# EAGLE schematic eightbyeight-teardrop (EAGLE 7.6.0)

## Sheet 1 of 6
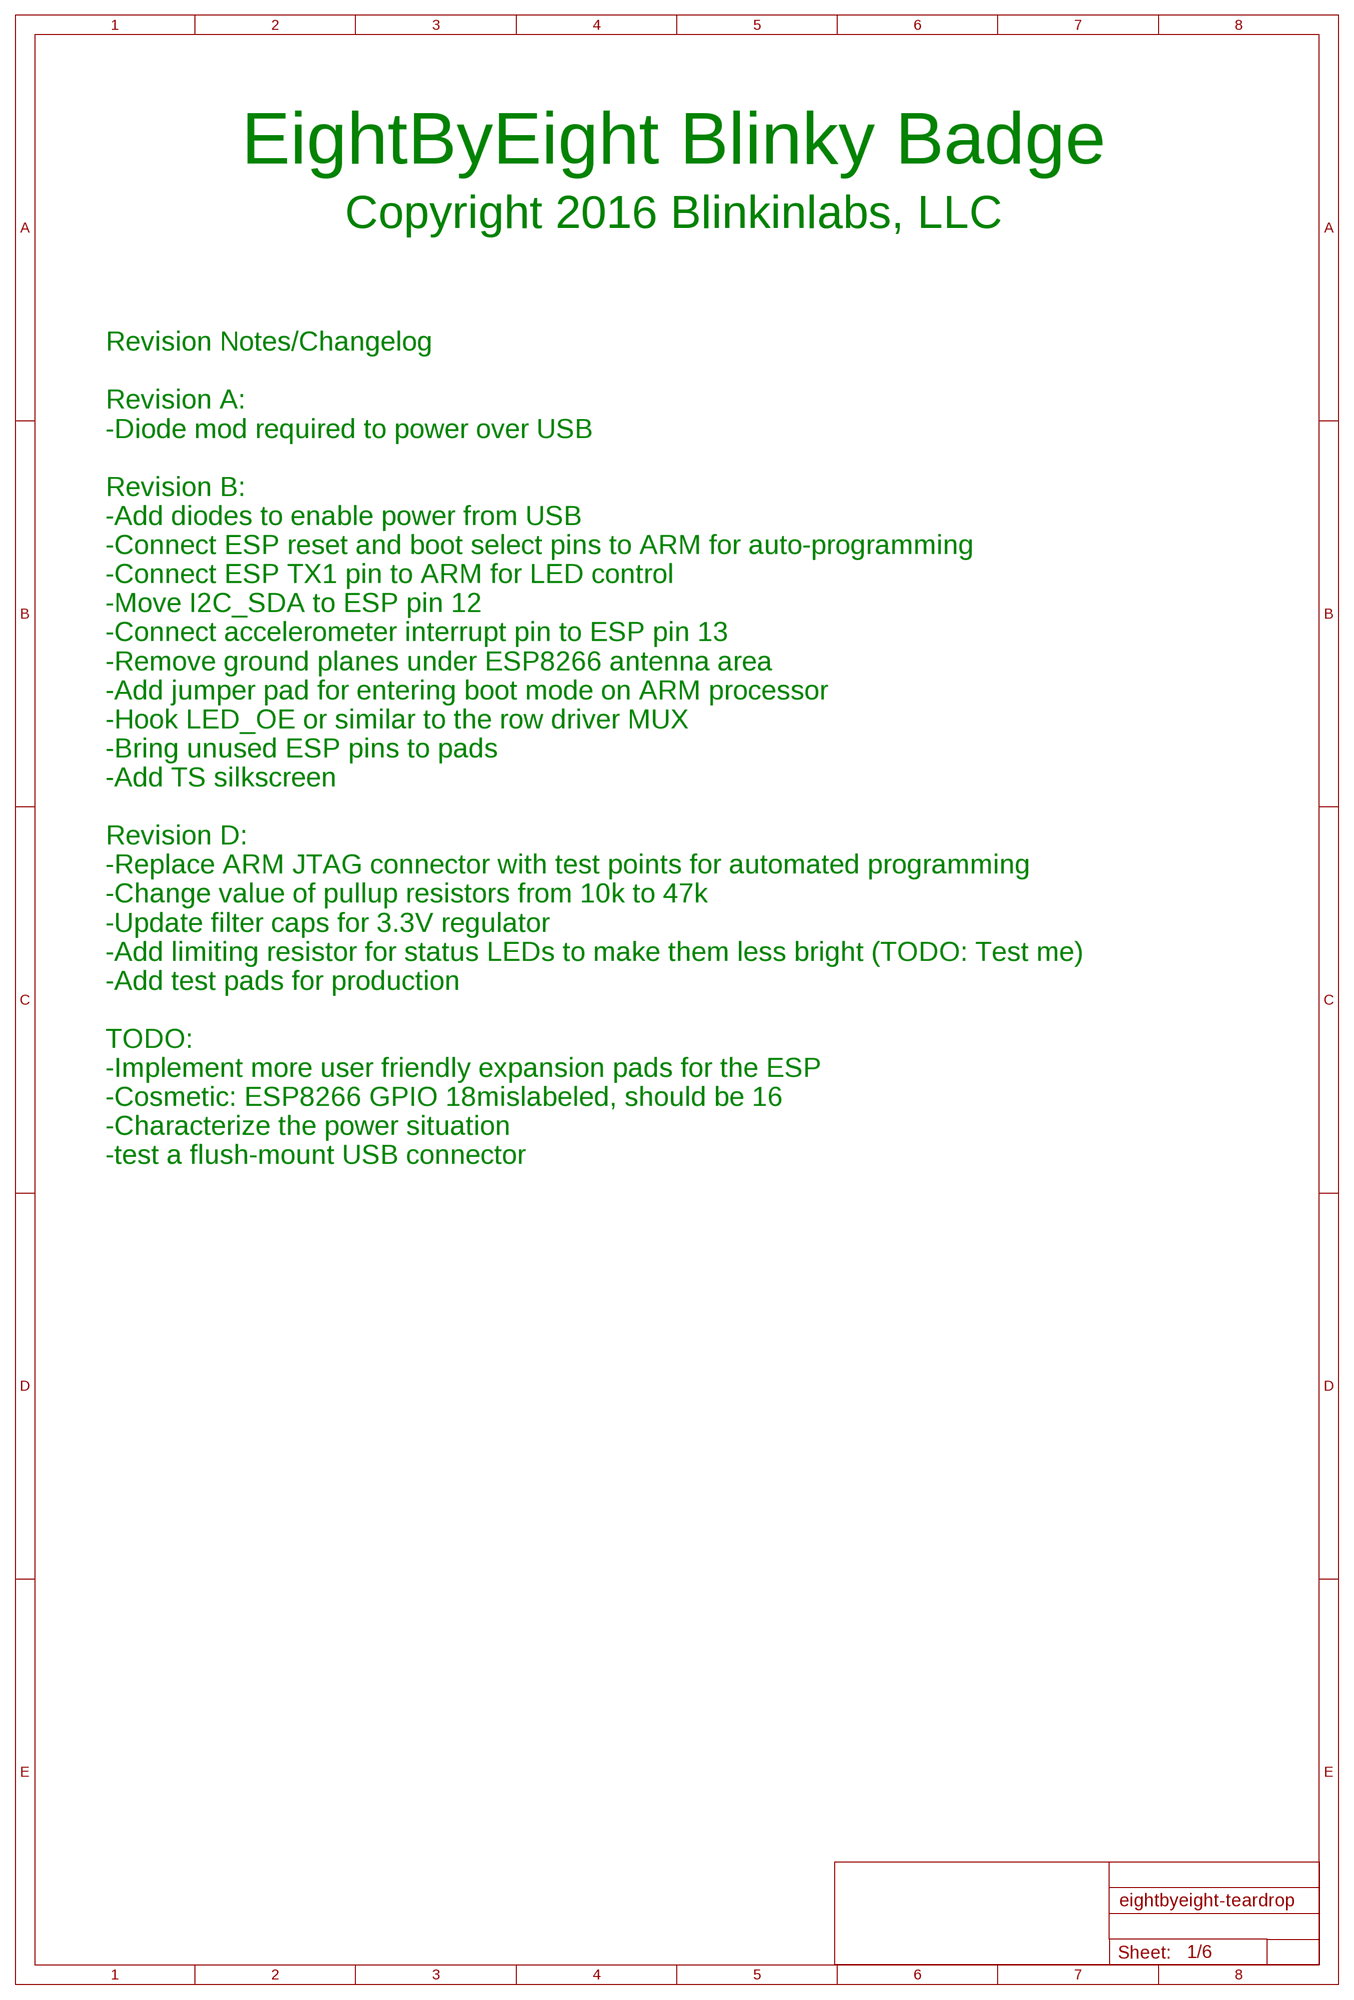
[diagram p0: schematic, sheet 1]

### Notes on the sheet
- EightByEight Blinky Badge
- Copyright 2016 Blinkinlabs, LLC
- Revision Notes/Changelog
  
  Revision A:
  -Diode mod required to power over USB
  
  Revision B:
  -Add diodes to enable power from USB
  -Connect ESP reset and boot select pins to ARM for auto-programming
  -Connect ESP TX1 pin to ARM for LED control
  -Move I2C_SDA to ESP pin 12
  -Connect accelerometer interrupt pin to ESP pin 13
  -Remove ground planes under ESP8266 antenna area
  -Add jumper pad for entering boot mode on ARM processor
  -Hook LED_OE or similar to the row driver MUX
  -Bring unused ESP pins to pads
  -Add TS silkscreen
  
  Revision D:
  -Replace ARM JTAG connector with test points for automated programming
  -Change value of pullup resistors from 10k to 47k
  -Update filter caps for 3.3V regulator
  -Add limiting resistor for status LEDs to make them less bright (TODO: Test me)
  -Add test pads for production
  
  TODO:
  -Implement more user friendly expansion pads for the ESP
  -Cosmetic: ESP8266 GPIO 18mislabeled, should be 16
  -Characterize the power situation
  -test a flush-mount USB connector

## Sheet 2 of 6
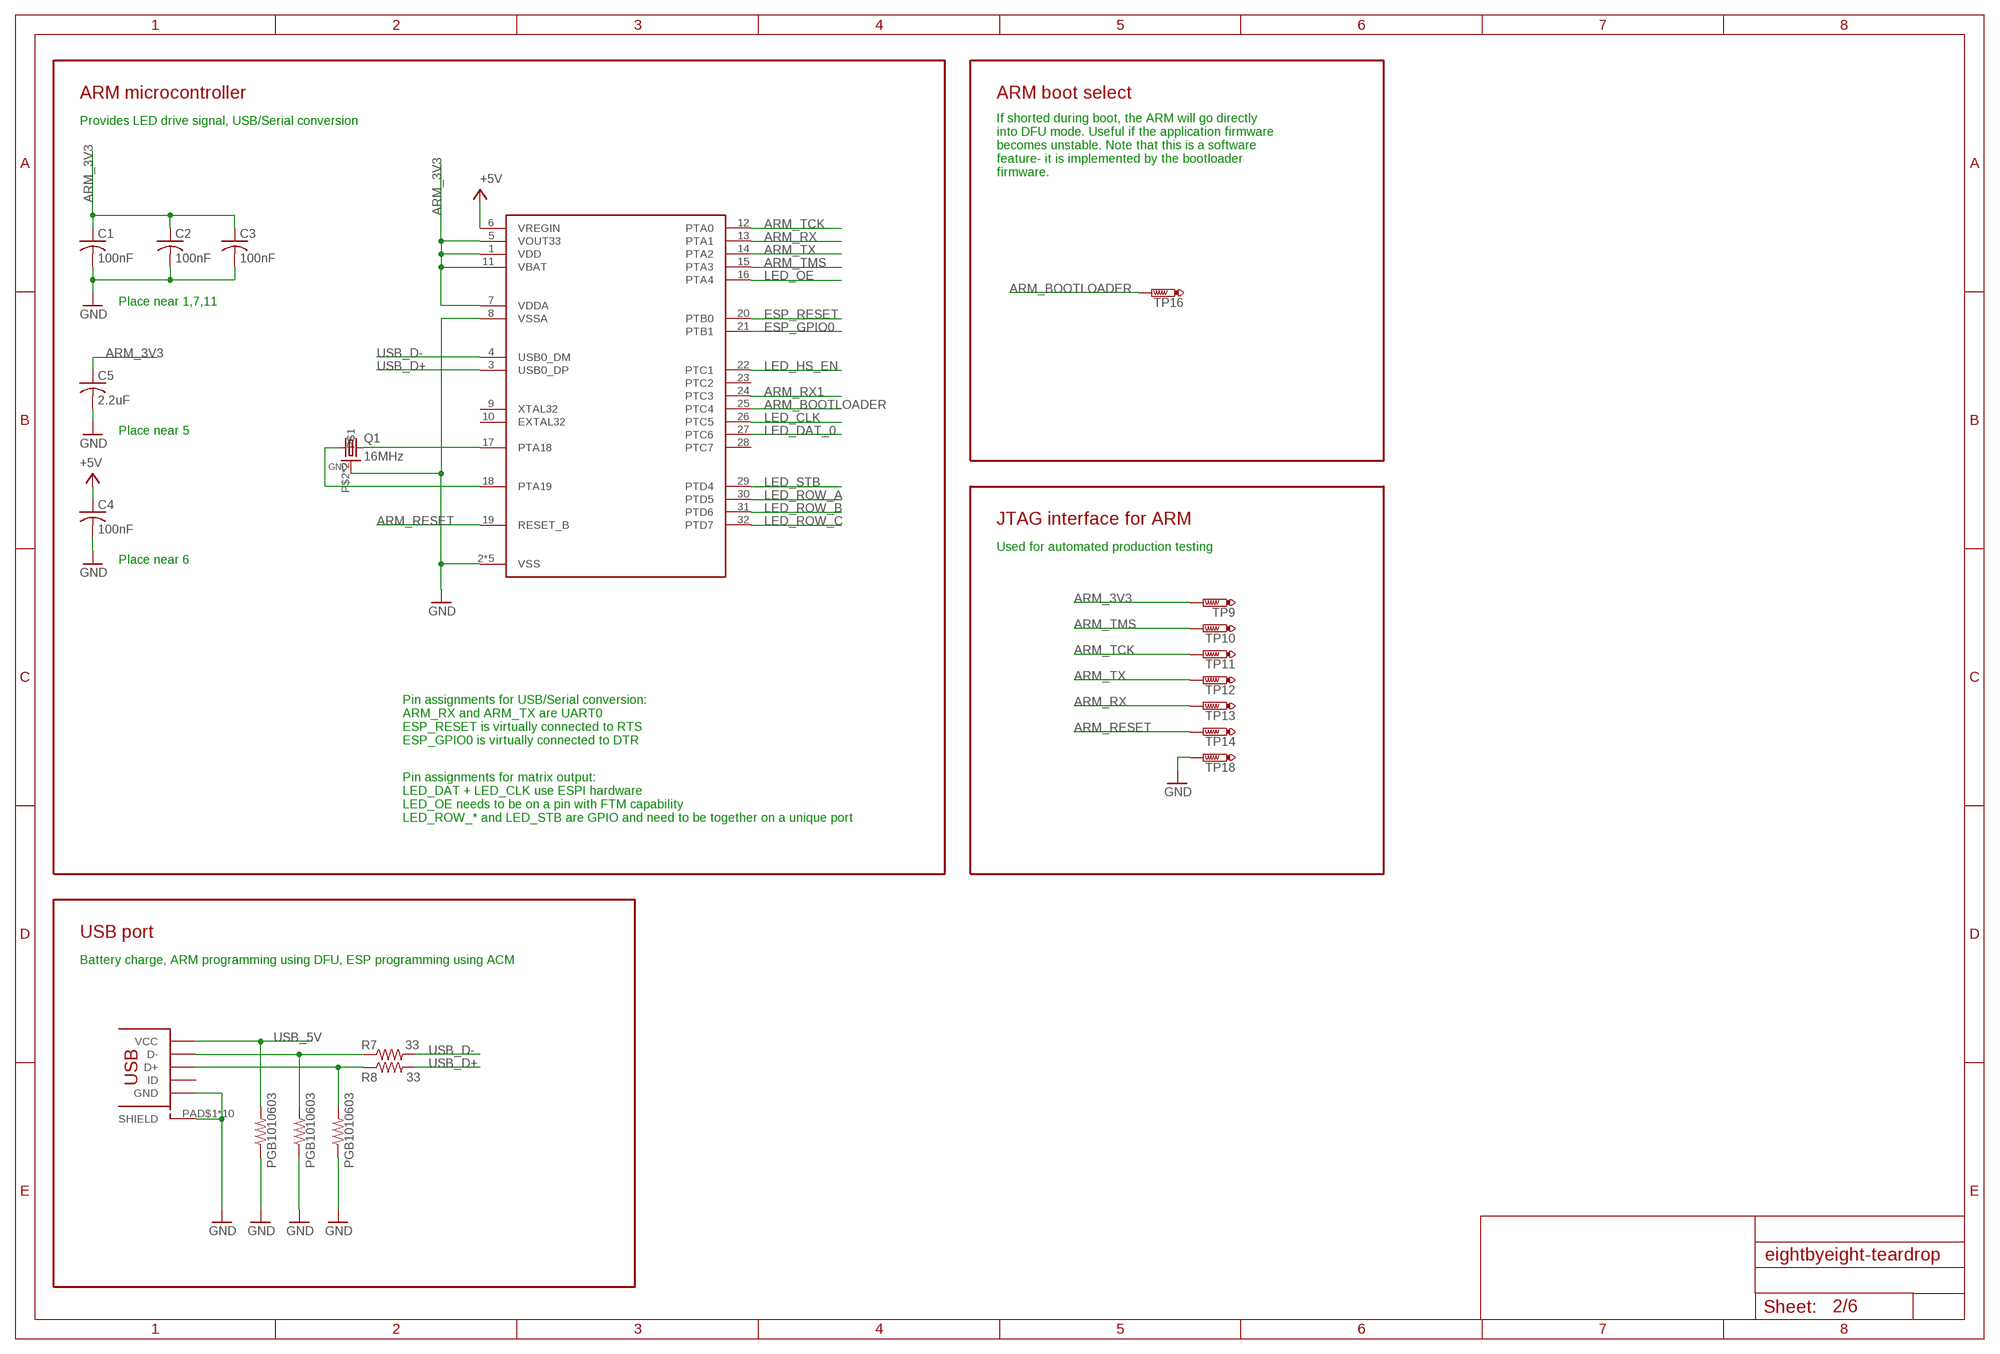
[diagram p1: schematic, sheet 2]

### Parts
C1  100nF  C-USC0402  [C0402]
C2  100nF  C-USC0402  [C0402]
C3  100nF  C-USC0402  [C0402]
C4  100nF  C-USC0402  [C0402]
C5  2.2uF  C-USC0402  [C0402]
CON1  USB_MICROSMT+THRUHULE  [USB_MICRO_THRUHOLE]
Q1  16MHz  CRYSTAL_4PAD2520  [CRSYTAL_2520]
R7  33  R-US_R0402  [R0402]
R8  33  R-US_R0402  [R0402]
TP9  PTR1B1,27  [B1,27]
TP10  PTR1B1,27  [B1,27]
TP11  PTR1B1,27  [B1,27]
TP12  PTR1B1,27  [B1,27]
TP13  PTR1B1,27  [B1,27]
TP14  PTR1B1,27  [B1,27]
TP16  PTR1B1,27  [B1,27]
TP18  PTR1B1,27  [B1,27]
U1  MK20DN64VFM5  MK20D--VFM5  [QFN32_5X5_LONGLEADS]
Z1  PGB1010603  SPARKFUN-RESISTORS_RESISTOR0603-RES  [SPARKFUN-RESISTORS_0603-RES]
Z2  PGB1010603  SPARKFUN-RESISTORS_RESISTOR0603-RES  [SPARKFUN-RESISTORS_0603-RES]
Z3  PGB1010603  SPARKFUN-RESISTORS_RESISTOR0603-RES  [SPARKFUN-RESISTORS_0603-RES]

### Nets
+5V: C4.1 U1.6(VREGIN) ; also sheet 4,5
ARM_3V3: C1.1 C2.1 C3.1 C5.1 TP9.TP U1.1(VDD) U1.5(VOUT33) U1.7(VDDA) U1.11(VBAT) ; also sheet 5
ARM_BOOTLOADER: TP16.TP U1.25(PTC4)
ARM_RESET: TP14.TP U1.19(RESET_B)
ARM_RX: TP13.TP U1.13(PTA1) ; also sheet 3
ARM_RX1: U1.24(PTC3) ; also sheet 3
ARM_TCK: TP11.TP U1.12(PTA0)
ARM_TMS: TP10.TP U1.15(PTA3)
ARM_TX: TP12.TP U1.14(PTA2) ; also sheet 3
ESP_GPIO0: U1.21(PTB1) ; also sheet 3
ESP_RESET: U1.20(PTB0) ; also sheet 3
GND: C1.2 C2.2 C3.2 C4.2 C5.2 CON1.PAD$1(SHIELD) CON1.PAD$2(SHIELD) CON1.PAD$3(SHIELD) CON1.PAD$4(SHIELD) CON1.PAD$5(SHIELD) CON1.PAD$6(SHIELD) CON1.PAD$7(SHIELD) CON1.PAD$8(SHIELD) CON1.PAD$9(SHIELD) CON1.PAD$10(SHIELD) CON1.PIN$5(GND) Q1.P$2 Q1.P$4 TP18.TP U1.2(VSS) U1.8(VSSA) U1.PAD@1(VSS) U1.PAD@4(VSS) U1.PAD@9(VSS) U1.PAD@11(VSS) Z1.1 Z2.1 Z3.1 ; also sheet 3,4,5
LED_CLK: U1.26(PTC5) ; also sheet 5
LED_DAT_0: U1.27(PTC6) ; also sheet 5
LED_HS_EN: U1.22(PTC1) ; also sheet 5
LED_OE: U1.16(PTA4) ; also sheet 5
LED_ROW_A: U1.30(PTD5) ; also sheet 5
LED_ROW_B: U1.31(PTD6) ; also sheet 5
LED_ROW_C: U1.32(PTD7) ; also sheet 5
LED_STB: U1.29(PTD4) ; also sheet 5
N$6: Q1.P$3 U1.17(PTA18)
N$9: CON1.PIN$2(D-) R7.1 Z1.2
N$10: CON1.PIN$3(D+) R8.1 Z2.2
N$61: Q1.P$1 U1.18(PTA19)
USB_5V: CON1.PIN$1(VCC) Z3.2 ; also sheet 4
USB_D+: R8.2 U1.3(USB0_DP)
USB_D-: R7.2 U1.4(USB0_DM)
Unconnected: CON1.PIN$4(ID) U1.9(XTAL32) U1.10(EXTAL32) U1.23(PTC2) U1.28(PTC7)

### Notes on the sheet
- ARM microcontroller | ARM boot select
- Provides LED drive signal, USB/Serial conversion
- If shorted during boot, the ARM will go directly
  into DFU mode. Useful if the application firmware
  becomes unstable. Note that this is a software
  feature- it is implemented by the bootloader
  firmware.
- Place near 1,7,11
- Place near 5
- JTAG interface for ARM
- Used for automated production testing
- Place near 6
- Pin assignments for USB/Serial conversion:
  ARM_RX and ARM_TX are UART0
  ESP_RESET is virtually connected to RTS
  ESP_GPIO0 is virtually connected to DTR
- Pin assignments for matrix output:
  LED_DAT + LED_CLK use ESPI hardware
  LED_OE needs to be on a pin with FTM capability
  LED_ROW_* and LED_STB are GPIO and need to be together on a unique port
- USB port
- Battery charge, ARM programming using DFU, ESP programming using ACM

## Sheet 3 of 6
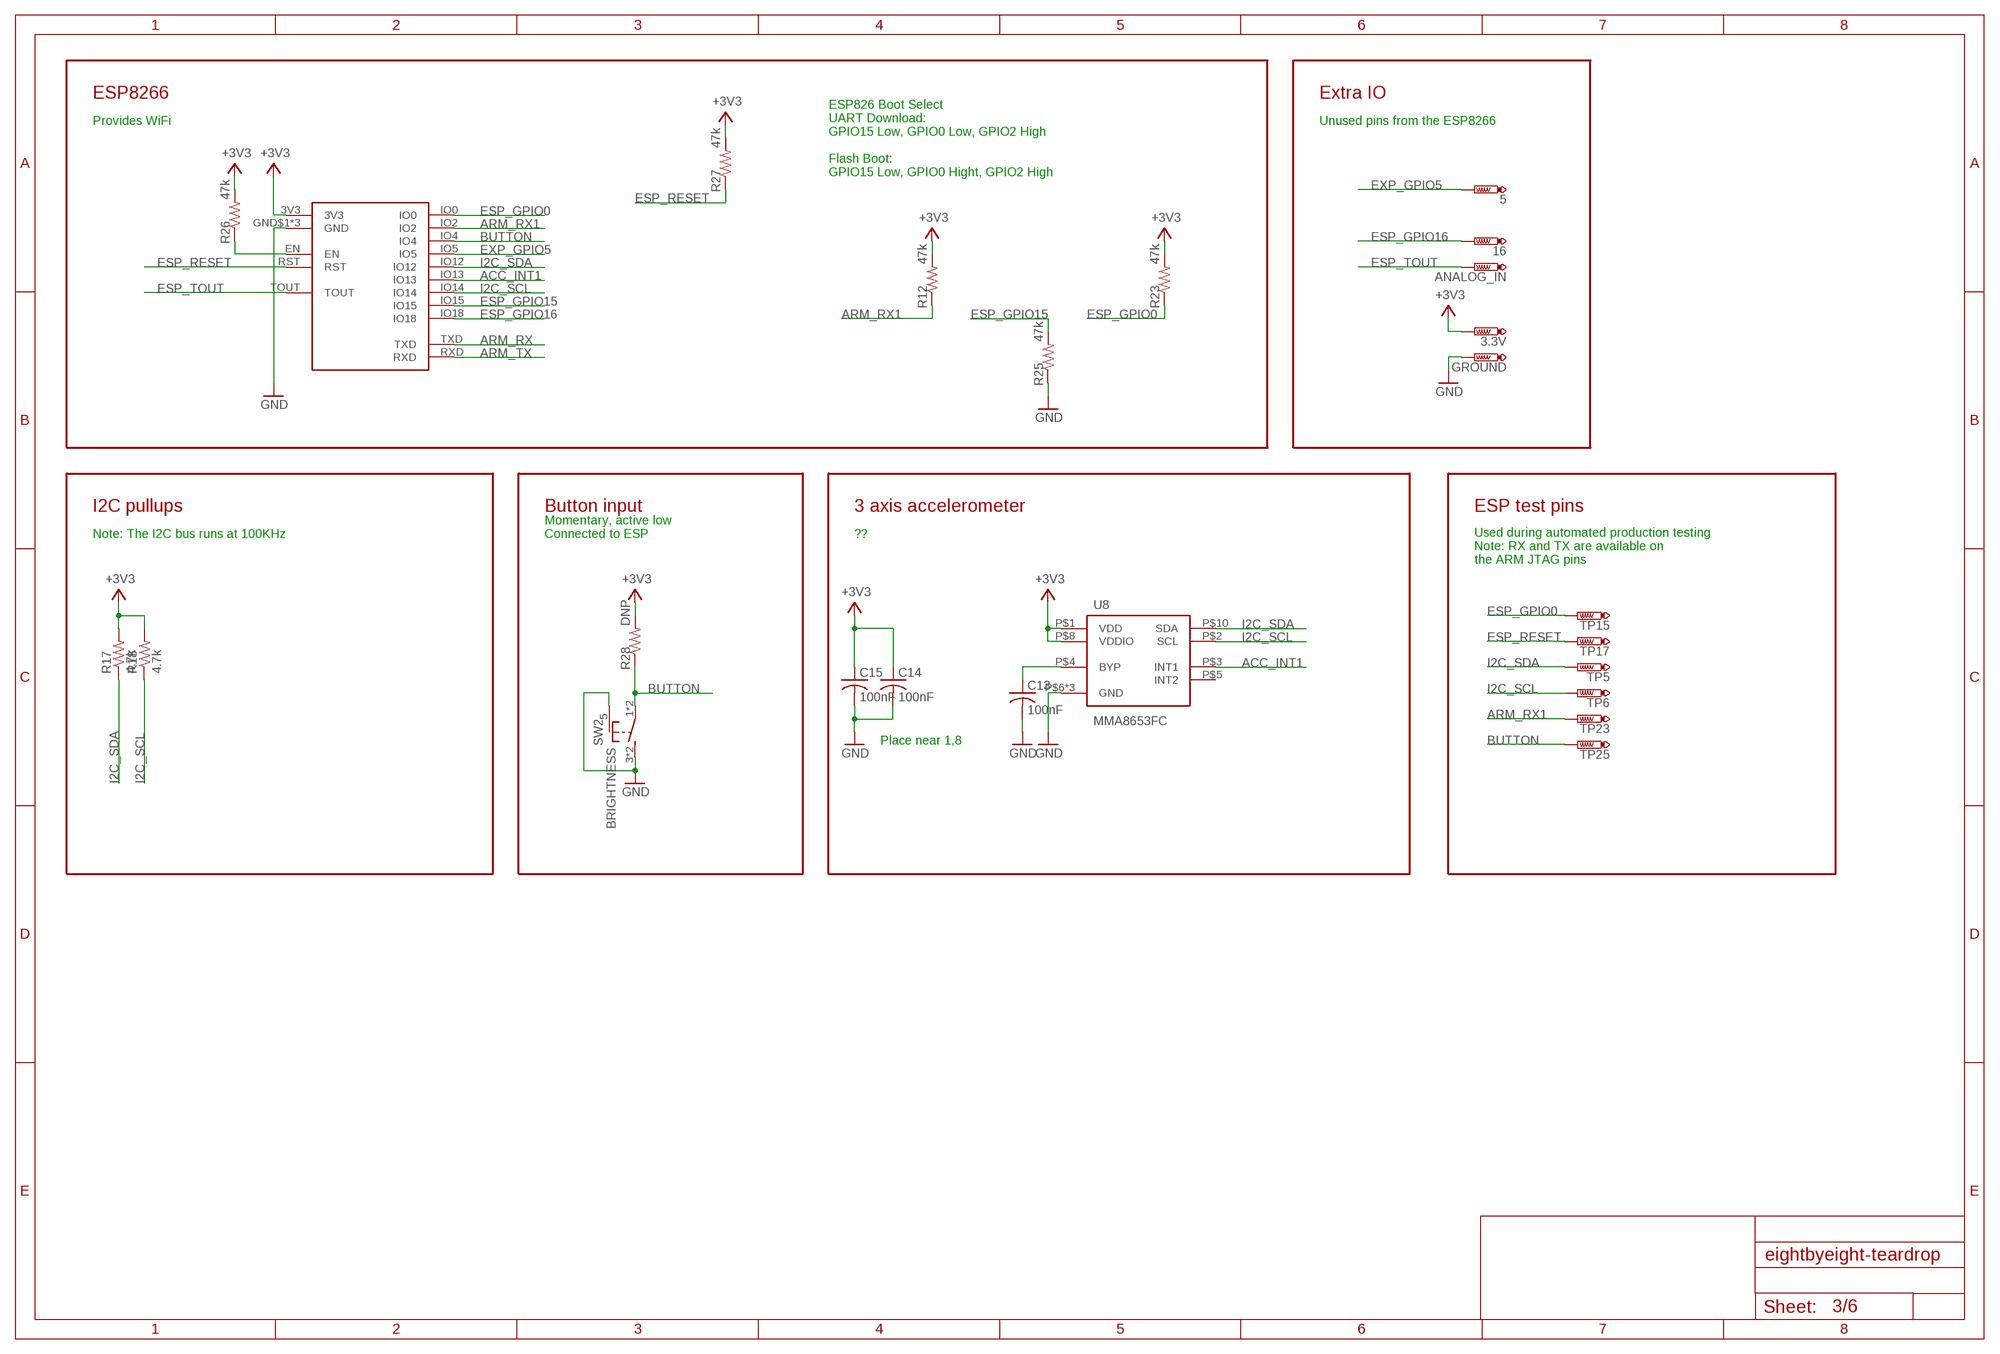
[diagram p2: schematic, sheet 3]

### Parts
3.3V  PTR1B2,54  [B2,54]
5  PTR1B2,54  [B2,54]
16  PTR1B2,54  [B2,54]
ANALOG_IN  PTR1B2,54  [B2,54]
C13  100nF  C-USC0402  [C0402]
C14  100nF  C-USC0402  [C0402]
C15  100nF  C-USC0402  [C0402]
GROUND  PTR1B2,54  [B2,54]
R12  47k  R-US_R0402  [R0402]
R17  4.7k  R-US_R0402  [R0402]
R18  4.7k  R-US_R0402  [R0402]
R23  47k  R-US_R0402  [R0402]
R25  47k  R-US_R0402  [R0402]
R26  47k  R-US_R0402  [R0402]
R27  47k  R-US_R0402  [R0402]
R28  DNP  R-US_R0402  [R0402]
SW2  BRIGHTNESS  BUTTON_MOMENTARY_GROUND  [TD-07XB]
TP5  PTR1B1,27  [B1,27]
TP6  PTR1B1,27  [B1,27]
TP15  PTR1B1,27  [B1,27]
TP17  PTR1B1,27  [B1,27]
TP23  PTR1B1,27  [B1,27]
TP25  PTR1B1,27  [B1,27]
U6  ESP_WROOM_02  [ESP_WROOM_02]
U8  MMA8653FC  [VFDFN-10]

### Nets
+3V3: 3.3V.TP C14.1 C15.1 R12.2 R17.2 R18.2 R23.2 R26.2 R27.2 R28.2 U6.3V3 U8.P$1(VDD) U8.P$8(VDDIO) ; also sheet 4
ACC_INT1: U6.IO13 U8.P$3(INT1)
ARM_RX: U6.TXD ; also sheet 2
ARM_RX1: R12.1 TP23.TP U6.IO2 ; also sheet 2
ARM_TX: U6.RXD ; also sheet 2
BUTTON: R28.1 SW2.1(P) SW2.2(P) TP25.TP U6.IO4
ESP_ENABLE: R26.1 U6.EN
ESP_GPIO0: R23.1 TP15.TP U6.IO0 ; also sheet 2
ESP_GPIO15: R25.2 U6.IO15
ESP_GPIO16: 16.TP U6.IO18
ESP_RESET: R27.1 TP17.TP U6.RST ; also sheet 2
ESP_TOUT: ANALOG_IN.TP U6.TOUT
EXP_GPIO5: 5.TP U6.IO5
GND: C13.2 C14.2 C15.2 GROUND.TP R25.1 SW2.3(S) SW2.4(S) SW2.5(SHIELD) U6.GND$1(GND) U6.GND$2(GND) U6.GND$3(GND) U8.P$6(GND) U8.P$7(GND) U8.P$9(GND) ; also sheet 2,4,5
I2C_SCL: R18.1 TP6.TP U6.IO14 U8.P$2(SCL)
I2C_SDA: R17.1 TP5.TP U6.IO12 U8.P$10(SDA)
N$5: C13.1 U8.P$4(BYP)
Unconnected: U8.P$5(INT2)

### Notes on the sheet
- ESP8266 | Extra IO
- Provides WiFi | Unused pins from the ESP8266
- ESP826 Boot Select
  UART Download:
  GPIO15 Low, GPIO0 Low, GPIO2 High
  
  Flash Boot:
  GPIO15 Low, GPIO0 Hight, GPIO2 High
- I2C pullups | Button input | 3 axis accelerometer | ESP test pins
- Note: The I2C bus runs at 100KHz
- Momentary, active low
  Connected to ESP
- ??
- Used during automated production testing
  Note: RX and TX are available on
  the ARM JTAG pins
- Place near 1,8

## Sheet 4 of 6
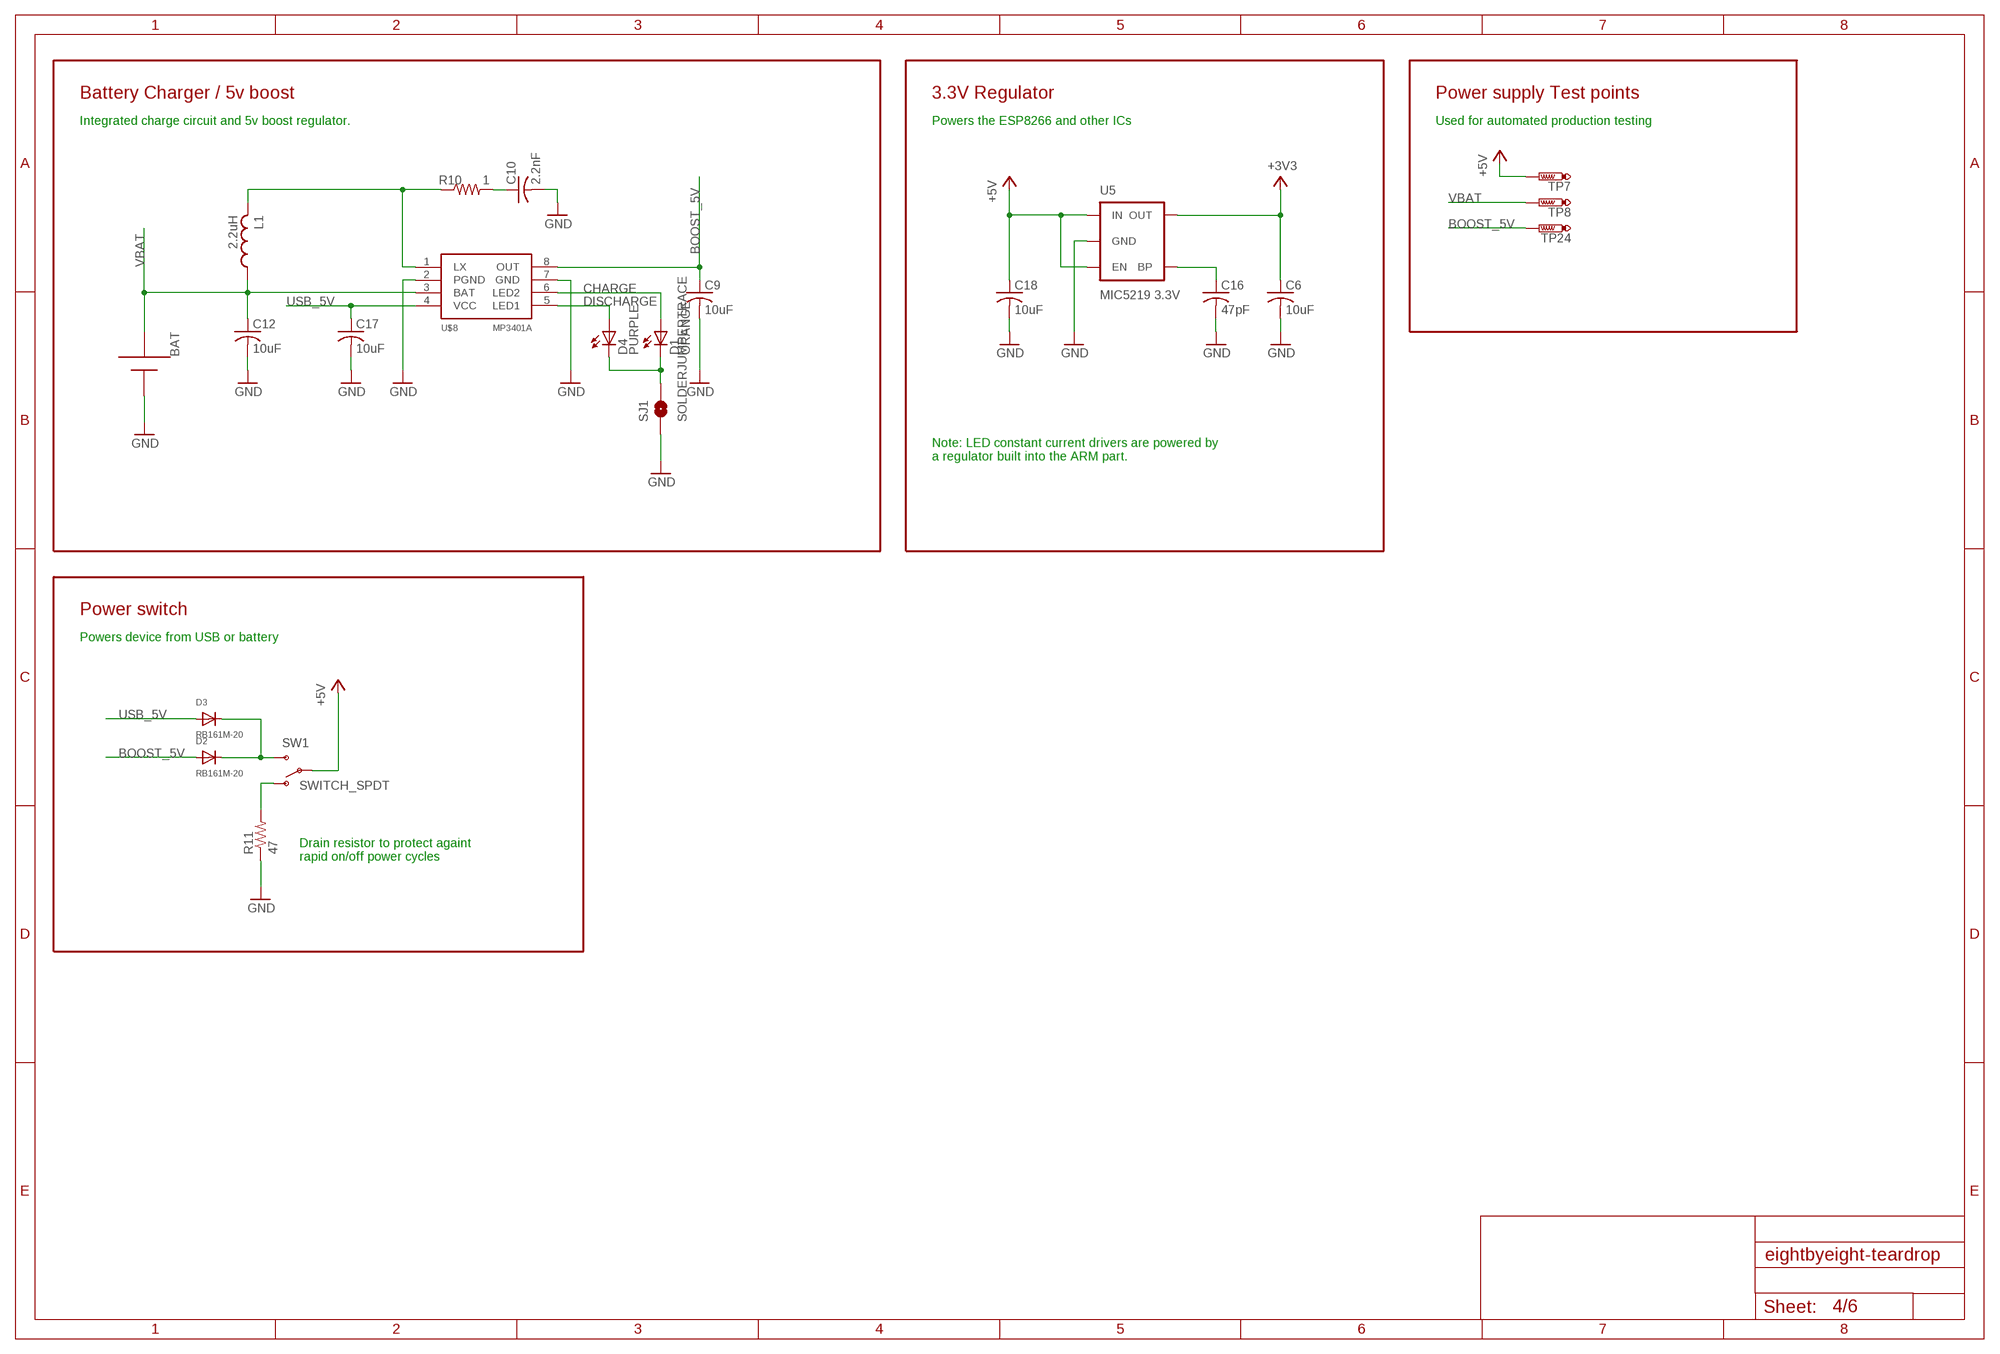
[diagram p3: schematic, sheet 4]

### Parts
BAT  BATTERY  [BATTERY_AA_SMD]
C6  10uF  C-USC0805  [C0805]
C9  10uF  C-USC0805  [C0805]
C10  2.2nF  C-USC0603  [C0603]
C12  10uF  C-USC0805  [C0805]
C16  47pF  C-USC0402  [C0402]
C17  10uF  C-USC0805  [C0805]
C18  10uF  C-USC0805  [C0805]
D1  ORANGE  LEDCHIP-LED0603  [CHIP-LED0603]
D2  RB161M-20  DIODESOD-123  [SOD-123]
D3  RB161M-20  DIODESOD-123  [SOD-123]
D4  PURPLE  LEDCHIP-LED0603  [CHIP-LED0603]
L1  2.2uH  LCD43  [INDUCTOR_CD43]
R10  1  R-US_R0603  [R0603]
R11  47  R-US_R0805  [R0805]
SJ1  SOLDERJUMPERTRACE  [SJ_2S-TRACE]
SW1  SWITCH_SPDT  [SWITCH_6P-2POS]
TP7  PTR1B1,27  [B1,27]
TP8  PTR1B1,27  [B1,27]
TP24  PTR1B1,27  [B1,27]
U5  MIC5219 3.3V  V_REG_MIC52193.3V  [SOT23-5]
U$8  MP3401A  [SO08-150]

### Nets
+3V3: C6.1 U5.5(OUT) ; also sheet 3
+5V: C18.1 SW1.P0(P) SW1.P1(P) TP7.TP U5.1(IN) U5.3(EN) ; also sheet 2,5
+5V_BLEED: R11.2 SW1.O0(O) SW1.O1(O)
+5V_SWITCH: D2.C D3.C SW1.S0(S) SW1.S1(S)
BOOST_5V: C9.1 D2.A TP24.TP U$8.8(OUT)
CHARGE: D1.A U$8.6(LED2)
DISCHARGE: D4.A U$8.5(LED1)
GND: BAT.- C6.2 C9.2 C10.2 C12.2 C16.2 C17.2 C18.2 R11.1 SJ1.1 U5.2(GND) U$8.2(PGND) U$8.7(GND) ; also sheet 2,3,5
N$1: D1.C D4.C SJ1.2
N$3: L1.P$2 R10.1 U$8.1(LX)
N$7: C10.1 R10.2
N$15: C16.1 U5.4(BP)
USB_5V: C17.1 D3.A U$8.4(VCC) ; also sheet 2
VBAT: BAT.+ C12.1 L1.P$1 TP8.TP U$8.3(BAT)

### Notes on the sheet
- Battery Charger / 5v boost | 3.3V Regulator | Power supply Test points
- Integrated charge circuit and 5v boost regulator. | Powers the ESP8266 and other ICs | Used for automated production testing
- Note: LED constant current drivers are powered by
  a regulator built into the ARM part.
- Power switch
- Powers device from USB or battery
- Drain resistor to protect againt
  rapid on/off power cycles

## Sheet 5 of 6
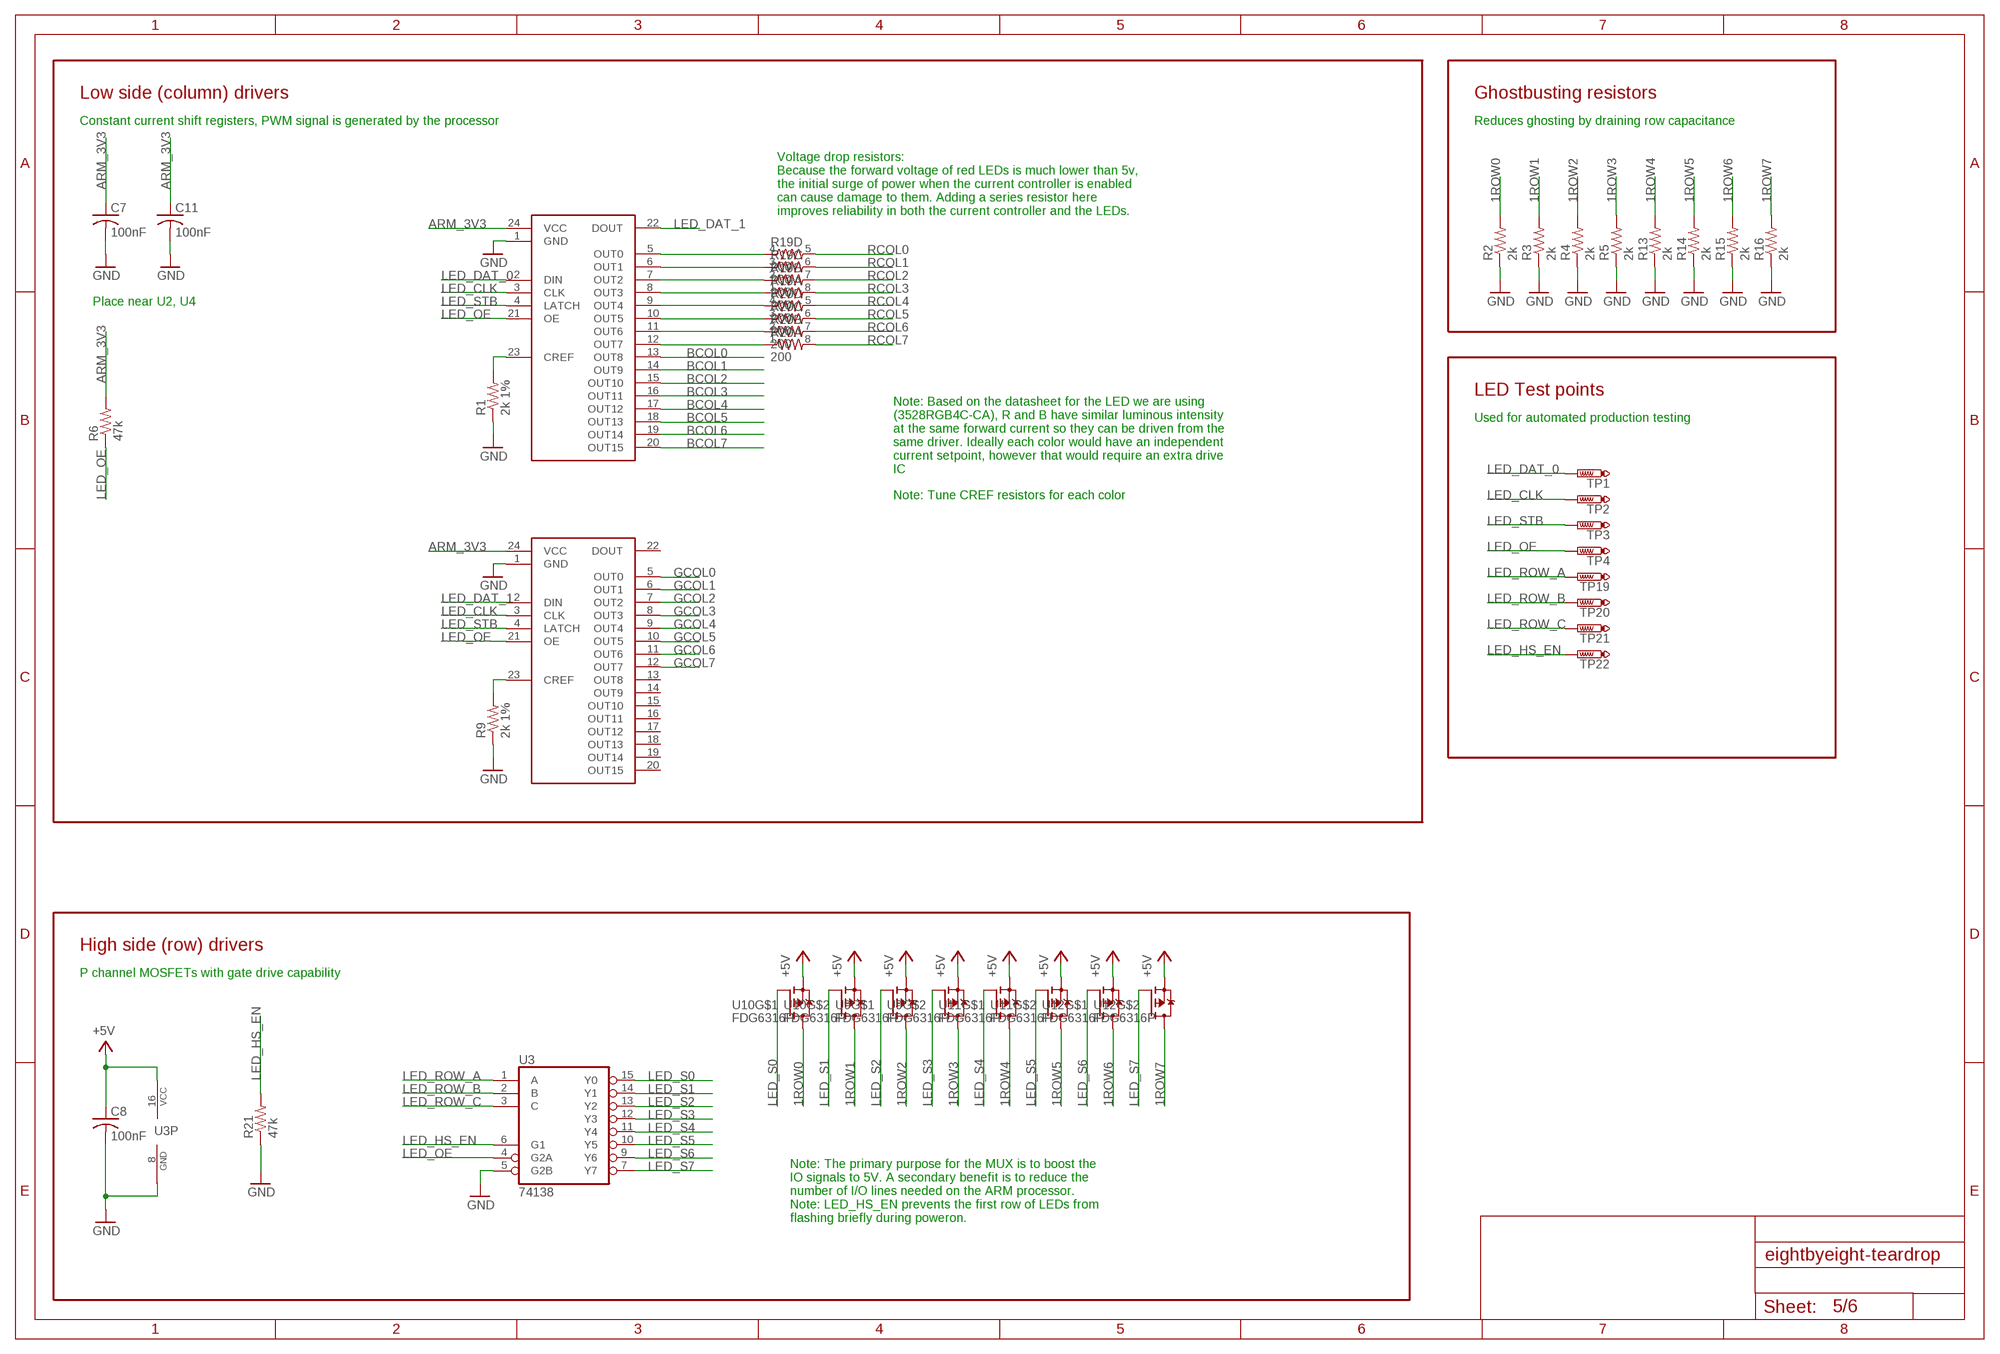
[diagram p4: schematic, sheet 5]

### Parts
C7  100nF  C-USC0402  [C0402]
C8  100nF  C-USC0402  [C0402]
C11  100nF  C-USC0402  [C0402]
R1  2k 1%  R-US_R0402  [R0402]
R2  2k  R-US_R0402  [R0402]
R3  2k  R-US_R0402  [R0402]
R4  2k  R-US_R0402  [R0402]
R5  2k  R-US_R0402  [R0402]
R6  47k  R-US_R0402  [R0402]
R9  2k 1%  R-US_R0402  [R0402]
R13  2k  R-US_R0402  [R0402]
R14  2k  R-US_R0402  [R0402]
R15  2k  R-US_R0402  [R0402]
R16  2k  R-US_R0402  [R0402]
R19  200  RESISTOR-ARRAY0603-ARV  [0603-ARV]
R20  200  RESISTOR-ARRAY0603-ARV  [0603-ARV]
R21  47k  R-US_R0402  [R0402]
TP1  PTR1B1,27  [B1,27]
TP2  PTR1B1,27  [B1,27]
TP3  PTR1B1,27  [B1,27]
TP4  PTR1B1,27  [B1,27]
TP19  PTR1B1,27  [B1,27]
TP20  PTR1B1,27  [B1,27]
TP21  PTR1B1,27  [B1,27]
TP22  PTR1B1,27  [B1,27]
U2  ICN2026  [SSOP24-150]
U3  74138  [TSSOP16]
U4  ICN2026  [SSOP24-150]
U9  FDG6316P  [SC70-6L]
U10  FDG6316P  [SC70-6L]
U11  FDG6316P  [SC70-6L]
U12  FDG6316P  [SC70-6L]

### Nets
1ROW0: R2.2 U10.6(D) ; also sheet 6
1ROW1: R3.2 U10.3(D) ; also sheet 6
1ROW2: R4.2 U9.6(D) ; also sheet 6
1ROW3: R5.2 U9.3(D) ; also sheet 6
1ROW4: R13.2 U11.6(D) ; also sheet 6
1ROW5: R14.2 U11.3(D) ; also sheet 6
1ROW6: R15.2 U12.6(D) ; also sheet 6
1ROW7: R16.2 U12.3(D) ; also sheet 6
+5V: C8.1 U3.16(VCC) U9.1(S) U9.4(S) U10.1(S) U10.4(S) U11.1(S) U11.4(S) U12.1(S) U12.4(S) ; also sheet 2,4
ARM_3V3: C7.1 C11.1 R6.2 U2.24(VCC) U4.24(VCC) ; also sheet 2
BCOL0: U2.13(OUT8) ; also sheet 6
BCOL1: U2.14(OUT9) ; also sheet 6
BCOL2: U2.15(OUT10) ; also sheet 6
BCOL3: U2.16(OUT11) ; also sheet 6
BCOL4: U2.17(OUT12) ; also sheet 6
BCOL5: U2.18(OUT13) ; also sheet 6
BCOL6: U2.19(OUT14) ; also sheet 6
BCOL7: U2.20(OUT15) ; also sheet 6
GCOL0: U4.5(OUT0) ; also sheet 6
GCOL1: U4.6(OUT1) ; also sheet 6
GCOL2: U4.7(OUT2) ; also sheet 6
GCOL3: U4.8(OUT3) ; also sheet 6
GCOL4: U4.9(OUT4) ; also sheet 6
GCOL5: U4.10(OUT5) ; also sheet 6
GCOL6: U4.11(OUT6) ; also sheet 6
GCOL7: U4.12(OUT7) ; also sheet 6
GND: C7.2 C8.2 C11.2 R1.1 R2.1 R3.1 R4.1 R5.1 R9.1 R13.1 R14.1 R15.1 R16.1 R21.1 U2.1(GND) U3.5(G2B) U3.8(GND) U4.1(GND) ; also sheet 2,3,4
LED_CLK: TP2.TP U2.3(CLK) U4.3(CLK) ; also sheet 2
LED_DAT_0: TP1.TP U2.2(DIN) ; also sheet 2
LED_DAT_1: U2.22(DOUT) U4.2(DIN)
LED_HS_EN: R21.2 TP22.TP U3.6(G1) ; also sheet 2
LED_OE: R6.1 TP4.TP U2.21(OE) U3.4(G2A) U4.21(OE) ; also sheet 2
LED_ROW_A: TP19.TP U3.1(A) ; also sheet 2
LED_ROW_B: TP20.TP U3.2(B) ; also sheet 2
LED_ROW_C: TP21.TP U3.3(C) ; also sheet 2
LED_S0: U3.15(Y0) U10.2(G)
LED_S1: U3.14(Y1) U10.5(G)
LED_S2: U3.13(Y2) U9.2(G)
LED_S3: U3.12(Y3) U9.5(G)
LED_S4: U3.11(Y4) U11.2(G)
LED_S5: U3.10(Y5) U11.5(G)
LED_S6: U3.9(Y6) U12.2(G)
LED_S7: U3.7(Y7) U12.5(G)
LED_STB: TP3.TP U2.4(LATCH) U4.4(LATCH) ; also sheet 2
N$2: R9.2 U4.23(CREF)
N$18: R1.2 U2.23(CREF)
RCOL0: R19.5 ; also sheet 6
RCOL0_: R19.4 U2.5(OUT0)
RCOL1: R19.6 ; also sheet 6
RCOL1_: R19.3 U2.6(OUT1)
RCOL2: R19.7 ; also sheet 6
RCOL2_: R19.2 U2.7(OUT2)
RCOL3: R19.8 ; also sheet 6
RCOL3_: R19.1 U2.8(OUT3)
RCOL4: R20.5 ; also sheet 6
RCOL4_: R20.4 U2.9(OUT4)
RCOL5: R20.6 ; also sheet 6
RCOL5_: R20.3 U2.10(OUT5)
RCOL6: R20.7 ; also sheet 6
RCOL6_: R20.2 U2.11(OUT6)
RCOL7: R20.8 ; also sheet 6
RCOL7_: R20.1 U2.12(OUT7)
Unconnected: U4.13(OUT8) U4.14(OUT9) U4.15(OUT10) U4.16(OUT11) U4.17(OUT12) U4.18(OUT13) U4.19(OUT14) U4.20(OUT15) U4.22(DOUT)

### Notes on the sheet
- Low side (column) drivers | Ghostbusting resistors
- Constant current shift registers, PWM signal is generated by the processor | Reduces ghosting by draining row capacitance
- Voltage drop resistors:
  Because the forward voltage of red LEDs is much lower than 5v,
  the initial surge of power when the current controller is enabled
  can cause damage to them. Adding a series resistor here
  improves reliability in both the current controller and the LEDs.
- Place near U2, U4
- LED Test points
- Used for automated production testing
- Note: Based on the datasheet for the LED we are using
  (3528RGB4C-CA), R and B have similar luminous intensity
  at the same forward current so they can be driven from the
  same driver. Ideally each color would have an independent
  current setpoint, however that would require an extra drive
  IC
- Note: Tune CREF resistors for each color
- High side (row) drivers
- P channel MOSFETs with gate drive capability
- Note: The primary purpose for the MUX is to boost the
  IO signals to 5V. A secondary benefit is to reduce the
  number of I/O lines needed on the ARM processor.
  Note: LED_HS_EN prevents the first row of LEDs from
  flashing briefly during poweron.

## Sheet 6 of 6
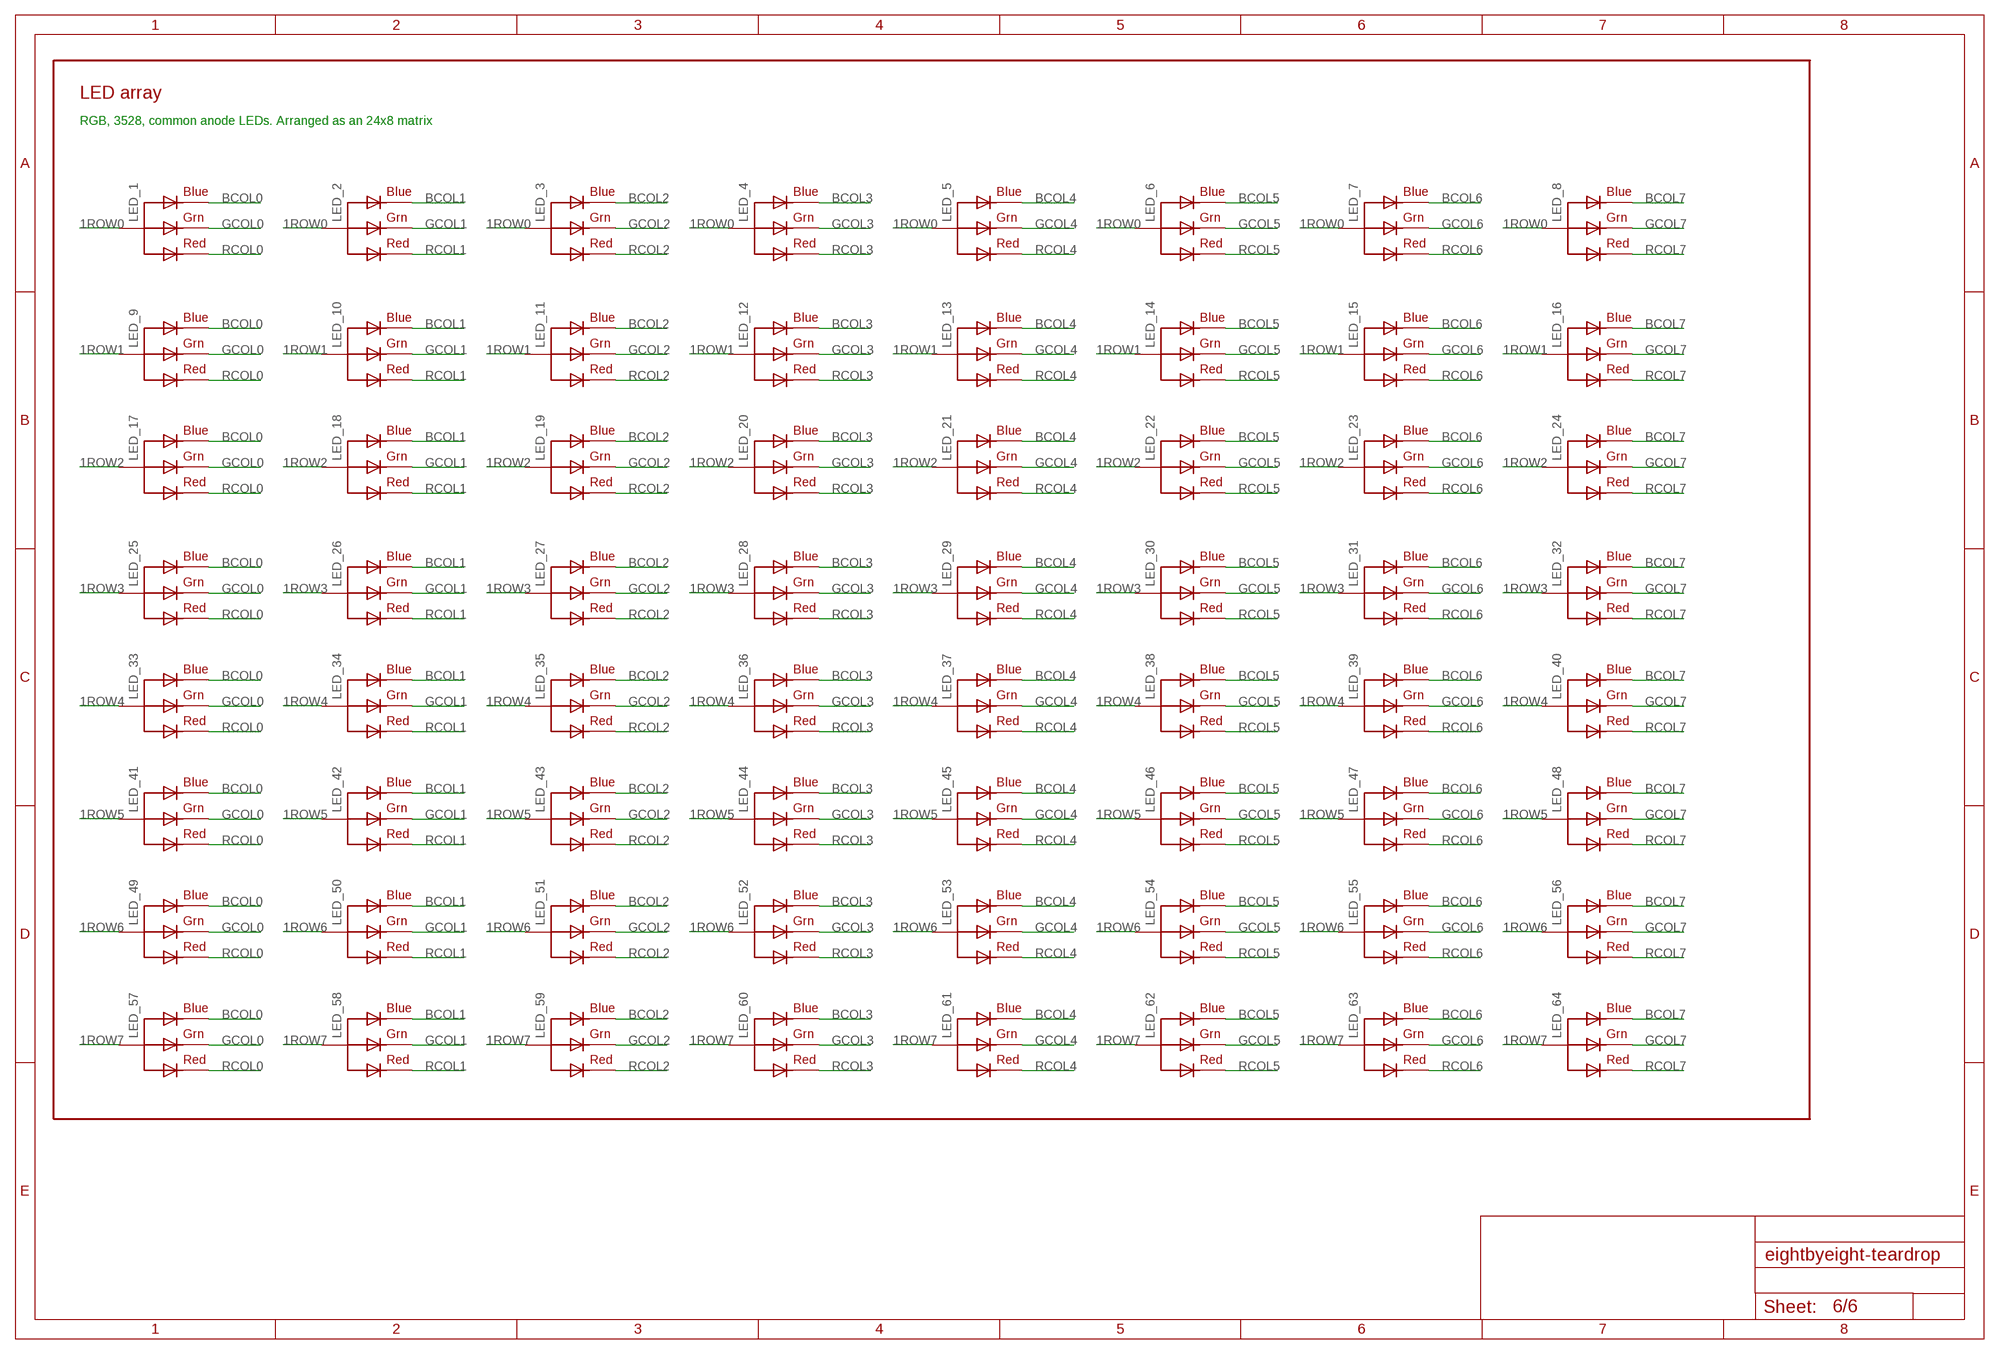
[diagram p5: schematic, sheet 6]

### Parts
LED_1  LED_RGB_CA  [LED_3528]
LED_2  LED_RGB_CA  [LED_3528]
LED_3  LED_RGB_CA  [LED_3528]
LED_4  LED_RGB_CA  [LED_3528]
LED_5  LED_RGB_CA  [LED_3528]
LED_6  LED_RGB_CA  [LED_3528]
LED_7  LED_RGB_CA  [LED_3528]
LED_8  LED_RGB_CA  [LED_3528]
LED_9  LED_RGB_CA  [LED_3528]
LED_10  LED_RGB_CA  [LED_3528]
LED_11  LED_RGB_CA  [LED_3528]
LED_12  LED_RGB_CA  [LED_3528]
LED_13  LED_RGB_CA  [LED_3528]
LED_14  LED_RGB_CA  [LED_3528]
LED_15  LED_RGB_CA  [LED_3528]
LED_16  LED_RGB_CA  [LED_3528]
LED_17  LED_RGB_CA  [LED_3528]
LED_18  LED_RGB_CA  [LED_3528]
LED_19  LED_RGB_CA  [LED_3528]
LED_20  LED_RGB_CA  [LED_3528]
LED_21  LED_RGB_CA  [LED_3528]
LED_22  LED_RGB_CA  [LED_3528]
LED_23  LED_RGB_CA  [LED_3528]
LED_24  LED_RGB_CA  [LED_3528]
LED_25  LED_RGB_CA  [LED_3528]
LED_26  LED_RGB_CA  [LED_3528]
LED_27  LED_RGB_CA  [LED_3528]
LED_28  LED_RGB_CA  [LED_3528]
LED_29  LED_RGB_CA  [LED_3528]
LED_30  LED_RGB_CA  [LED_3528]
LED_31  LED_RGB_CA  [LED_3528]
LED_32  LED_RGB_CA  [LED_3528]
LED_33  LED_RGB_CA  [LED_3528]
LED_34  LED_RGB_CA  [LED_3528]
LED_35  LED_RGB_CA  [LED_3528]
LED_36  LED_RGB_CA  [LED_3528]
LED_37  LED_RGB_CA  [LED_3528]
LED_38  LED_RGB_CA  [LED_3528]
LED_39  LED_RGB_CA  [LED_3528]
LED_40  LED_RGB_CA  [LED_3528]
LED_41  LED_RGB_CA  [LED_3528]
LED_42  LED_RGB_CA  [LED_3528]
LED_43  LED_RGB_CA  [LED_3528]
LED_44  LED_RGB_CA  [LED_3528]
LED_45  LED_RGB_CA  [LED_3528]
LED_46  LED_RGB_CA  [LED_3528]
LED_47  LED_RGB_CA  [LED_3528]
LED_48  LED_RGB_CA  [LED_3528]
LED_49  LED_RGB_CA  [LED_3528]
LED_50  LED_RGB_CA  [LED_3528]
LED_51  LED_RGB_CA  [LED_3528]
LED_52  LED_RGB_CA  [LED_3528]
LED_53  LED_RGB_CA  [LED_3528]
LED_54  LED_RGB_CA  [LED_3528]
LED_55  LED_RGB_CA  [LED_3528]
LED_56  LED_RGB_CA  [LED_3528]
LED_57  LED_RGB_CA  [LED_3528]
LED_58  LED_RGB_CA  [LED_3528]
LED_59  LED_RGB_CA  [LED_3528]
LED_60  LED_RGB_CA  [LED_3528]
LED_61  LED_RGB_CA  [LED_3528]
LED_62  LED_RGB_CA  [LED_3528]
LED_63  LED_RGB_CA  [LED_3528]
LED_64  LED_RGB_CA  [LED_3528]

### Nets
1ROW0: LED_1.2(VCC) LED_2.2(VCC) LED_3.2(VCC) LED_4.2(VCC) LED_5.2(VCC) LED_6.2(VCC) LED_7.2(VCC) LED_8.2(VCC) ; also sheet 5
1ROW1: LED_9.2(VCC) LED_10.2(VCC) LED_11.2(VCC) LED_12.2(VCC) LED_13.2(VCC) LED_14.2(VCC) LED_15.2(VCC) LED_16.2(VCC) ; also sheet 5
1ROW2: LED_17.2(VCC) LED_18.2(VCC) LED_19.2(VCC) LED_20.2(VCC) LED_21.2(VCC) LED_22.2(VCC) LED_23.2(VCC) LED_24.2(VCC) ; also sheet 5
1ROW3: LED_25.2(VCC) LED_26.2(VCC) LED_27.2(VCC) LED_28.2(VCC) LED_29.2(VCC) LED_30.2(VCC) LED_31.2(VCC) LED_32.2(VCC) ; also sheet 5
1ROW4: LED_33.2(VCC) LED_34.2(VCC) LED_35.2(VCC) LED_36.2(VCC) LED_37.2(VCC) LED_38.2(VCC) LED_39.2(VCC) LED_40.2(VCC) ; also sheet 5
1ROW5: LED_41.2(VCC) LED_42.2(VCC) LED_43.2(VCC) LED_44.2(VCC) LED_45.2(VCC) LED_46.2(VCC) LED_47.2(VCC) LED_48.2(VCC) ; also sheet 5
1ROW6: LED_49.2(VCC) LED_50.2(VCC) LED_51.2(VCC) LED_52.2(VCC) LED_53.2(VCC) LED_54.2(VCC) LED_55.2(VCC) LED_56.2(VCC) ; also sheet 5
1ROW7: LED_57.2(VCC) LED_58.2(VCC) LED_59.2(VCC) LED_60.2(VCC) LED_61.2(VCC) LED_62.2(VCC) LED_63.2(VCC) LED_64.2(VCC) ; also sheet 5
BCOL0: LED_1.3(BLUE) LED_9.3(BLUE) LED_17.3(BLUE) LED_25.3(BLUE) LED_33.3(BLUE) LED_41.3(BLUE) LED_49.3(BLUE) LED_57.3(BLUE) ; also sheet 5
BCOL1: LED_2.3(BLUE) LED_10.3(BLUE) LED_18.3(BLUE) LED_26.3(BLUE) LED_34.3(BLUE) LED_42.3(BLUE) LED_50.3(BLUE) LED_58.3(BLUE) ; also sheet 5
BCOL2: LED_3.3(BLUE) LED_11.3(BLUE) LED_19.3(BLUE) LED_27.3(BLUE) LED_35.3(BLUE) LED_43.3(BLUE) LED_51.3(BLUE) LED_59.3(BLUE) ; also sheet 5
BCOL3: LED_4.3(BLUE) LED_12.3(BLUE) LED_20.3(BLUE) LED_28.3(BLUE) LED_36.3(BLUE) LED_44.3(BLUE) LED_52.3(BLUE) LED_60.3(BLUE) ; also sheet 5
BCOL4: LED_5.3(BLUE) LED_13.3(BLUE) LED_21.3(BLUE) LED_29.3(BLUE) LED_37.3(BLUE) LED_45.3(BLUE) LED_53.3(BLUE) LED_61.3(BLUE) ; also sheet 5
BCOL5: LED_6.3(BLUE) LED_14.3(BLUE) LED_22.3(BLUE) LED_30.3(BLUE) LED_38.3(BLUE) LED_46.3(BLUE) LED_54.3(BLUE) LED_62.3(BLUE) ; also sheet 5
BCOL6: LED_7.3(BLUE) LED_15.3(BLUE) LED_23.3(BLUE) LED_31.3(BLUE) LED_39.3(BLUE) LED_47.3(BLUE) LED_55.3(BLUE) LED_63.3(BLUE) ; also sheet 5
BCOL7: LED_8.3(BLUE) LED_16.3(BLUE) LED_24.3(BLUE) LED_32.3(BLUE) LED_40.3(BLUE) LED_48.3(BLUE) LED_56.3(BLUE) LED_64.3(BLUE) ; also sheet 5
GCOL0: LED_1.4(GREEN) LED_9.4(GREEN) LED_17.4(GREEN) LED_25.4(GREEN) LED_33.4(GREEN) LED_41.4(GREEN) LED_49.4(GREEN) LED_57.4(GREEN) ; also sheet 5
GCOL1: LED_2.4(GREEN) LED_10.4(GREEN) LED_18.4(GREEN) LED_26.4(GREEN) LED_34.4(GREEN) LED_42.4(GREEN) LED_50.4(GREEN) LED_58.4(GREEN) ; also sheet 5
GCOL2: LED_3.4(GREEN) LED_11.4(GREEN) LED_19.4(GREEN) LED_27.4(GREEN) LED_35.4(GREEN) LED_43.4(GREEN) LED_51.4(GREEN) LED_59.4(GREEN) ; also sheet 5
GCOL3: LED_4.4(GREEN) LED_12.4(GREEN) LED_20.4(GREEN) LED_28.4(GREEN) LED_36.4(GREEN) LED_44.4(GREEN) LED_52.4(GREEN) LED_60.4(GREEN) ; also sheet 5
GCOL4: LED_5.4(GREEN) LED_13.4(GREEN) LED_21.4(GREEN) LED_29.4(GREEN) LED_37.4(GREEN) LED_45.4(GREEN) LED_53.4(GREEN) LED_61.4(GREEN) ; also sheet 5
GCOL5: LED_6.4(GREEN) LED_14.4(GREEN) LED_22.4(GREEN) LED_30.4(GREEN) LED_38.4(GREEN) LED_46.4(GREEN) LED_54.4(GREEN) LED_62.4(GREEN) ; also sheet 5
GCOL6: LED_7.4(GREEN) LED_15.4(GREEN) LED_23.4(GREEN) LED_31.4(GREEN) LED_39.4(GREEN) LED_47.4(GREEN) LED_55.4(GREEN) LED_63.4(GREEN) ; also sheet 5
GCOL7: LED_8.4(GREEN) LED_16.4(GREEN) LED_24.4(GREEN) LED_32.4(GREEN) LED_40.4(GREEN) LED_48.4(GREEN) LED_56.4(GREEN) LED_64.4(GREEN) ; also sheet 5
RCOL0: LED_1.1(RED) LED_9.1(RED) LED_17.1(RED) LED_25.1(RED) LED_33.1(RED) LED_41.1(RED) LED_49.1(RED) LED_57.1(RED) ; also sheet 5
RCOL1: LED_2.1(RED) LED_10.1(RED) LED_18.1(RED) LED_26.1(RED) LED_34.1(RED) LED_42.1(RED) LED_50.1(RED) LED_58.1(RED) ; also sheet 5
RCOL2: LED_3.1(RED) LED_11.1(RED) LED_19.1(RED) LED_27.1(RED) LED_35.1(RED) LED_43.1(RED) LED_51.1(RED) LED_59.1(RED) ; also sheet 5
RCOL3: LED_4.1(RED) LED_12.1(RED) LED_20.1(RED) LED_28.1(RED) LED_36.1(RED) LED_44.1(RED) LED_52.1(RED) LED_60.1(RED) ; also sheet 5
RCOL4: LED_5.1(RED) LED_13.1(RED) LED_21.1(RED) LED_29.1(RED) LED_37.1(RED) LED_45.1(RED) LED_53.1(RED) LED_61.1(RED) ; also sheet 5
RCOL5: LED_6.1(RED) LED_14.1(RED) LED_22.1(RED) LED_30.1(RED) LED_38.1(RED) LED_46.1(RED) LED_54.1(RED) LED_62.1(RED) ; also sheet 5
RCOL6: LED_7.1(RED) LED_15.1(RED) LED_23.1(RED) LED_31.1(RED) LED_39.1(RED) LED_47.1(RED) LED_55.1(RED) LED_63.1(RED) ; also sheet 5
RCOL7: LED_8.1(RED) LED_16.1(RED) LED_24.1(RED) LED_32.1(RED) LED_40.1(RED) LED_48.1(RED) LED_56.1(RED) LED_64.1(RED) ; also sheet 5

### Notes on the sheet
- LED array
- RGB, 3528, common anode LEDs. Arranged as an 24x8 matrix

## Library data of the parts
3.3V 5 16 ANALOG_IN GROUND TP1-TP25 = testpad:PTR1: TEST PIN
BAT = blinkinlabs:BATTERY
C1-C18 = adafruit:C-US: CAPACITOR, American symbol
CON1 = blinkinlabs:USB_MICRO
D1 D4 = adafruit:LED: LED OSRAM: - CHIPLED LG R971, LG N971, LY N971, LG Q971, LY Q971, LO R971, LY R971 LH N974, LH R974 LS Q976, LO Q976, LY Q976 LO Q996 - Hyper CHIPLED LW Q18S LB Q993, LB Q99A, LB R99A - SideLED LS A670, LO A670, LY A670, LG A670, LP A670 LB A673, LV A673, LT A673, LW A673 LH A674 LY A675 LS A676, LA A676, LO A676, LY A676, LW A676 LS A679, LY A679, LG A679 - Hyper Micro SIDELED® LS Y876, LA Y876, LO Y876, LY Y876 LT Y87S - SmartLED LW L88C, LW L88S LB L89C, LB L89S, LG L890 LS L89K, LO L89K, LY L89K LS L896, LA L896, LO L896, LY L896 - TOPLED LS T670, LO T670, LY T670, LG T670, LP T670 LSG T670, LSP T670, LSY T670, LOP T670, LYG T670 LG T671, LOG T671, LSG T671 LB T673, LV T673, LT T673, LW T673 LH T674 LS T676, LA T676, LO T676, LY T676, LB T676, LH T676, LSB T676, LW T676 LB T67C, LV T67C, LT T67C, LS T67K, LO T67K, LY T67K, LW E67C LS E67B, LA E67B, LO E67B, LY E67B, LB E67C, LV E67C, LT E67C LW T67C LS T679, LY T679, LG T679 LS T770, LO T770, LY T770, LG T770, LP T770 LB T773, LV T773, LT T773, LW T773 LH T774 LS E675, LA E675, LY E675, LS T675 LS T776, LA T776, LO T776, LY T776, LB T776 LHGB T686 LT T68C, LB T68C - Hyper Mini TOPLED® LB M676 - Mini TOPLED Santana® LG M470 LS M47K, LO M47K, LY M47K Source: http://www.osram.convergy.de/
D2 D3 = adafruit:DIODE: Diode SMADIODE - SMA Surface Mount Package 20V 1A Schottky Diode Digikey: 641-1014-6-ND DO-1N4148 - Through Hole Small Current Diode SOD-123 20V 1 A (.5mV Vf) Schottky Diode - Digikey: MBRX120TPMSCT-ND SOD-323 10V 570mA (.38mV Vf, 3ns) Schottky Diode - Digikey: ZLLS410CT-ND SOD-523 30V 30mA Schottky Diode (RB751S-40TE61) - Digikey: RB751S-40TE61CT-ND SOT23-R/W - SOT23 Package (R = Solder Paste/Reflow Ovens, W = Hand-Soldering) BAT54Film 40V 300mA - Digikey: 497-7162-1-ND
L1 = blinkinlabs:L
LED_1-LED_64 = blinkinlabs:LED_RGB_CA
Q1 = blinkinlabs:CRYSTAL_4PAD
R1-R18 R21 R23 R25-R28 = adafruit:R-US_: RESISTOR, American symbol
R19 R20 = SparkFun-Passives:RESISTOR-ARRAY: Array Chip Resistor Source: RS Component / Phycomp
SJ1 = SparkFun-Passives:SOLDERJUMPER: Solder Jumper Standard SMD solder jumper. Used to automate production. Two varients : Normally Open and Normally Closed are the same, but have different paste layers. NC will have a large amount of paste and should jumper during reflow.
SW1 = blinkinlabs:SWITCH_SPDT
SW2 = blinkinlabs:BUTTON_MOMENTARY_GROUND
U1 = blinkinlabs:MK20D--VFM5
U2 U4 = blinkinlabs:ICN2026
U3 = blinkinlabs:74*138: 3-line to 8-line DECODER/DEMULTIPLEXER
U5 = SparkFun-PowerIC:V_REG_MIC5219: V_REG MIC5219 Standard 3.3V and 5V 500mA LDO voltage regulator in SOT-23 layout. Micrel part MIC5219. BP (by-pass) pin is used to lower output noise with 470pF cap, may be left open.; PROD_ID: VREG-09872
U6 = blinkinlabs:ESP_WROOM_02
U8 = teensy_adapter:MMA8653FC
U9-U12 = teensy_adapter:FDG6316P
U$8 = blinkinlabs:MP3401A
Z1-Z3 = PaxInstrument-T400:SPARKFUN-RESISTORS_RESISTOR: Resistor Basic schematic elements and footprints for 0603, 1206, and PTH resistors.; MF: Littelfuse; MPN: PGB1010603NRHF

## Net classes
1 power: width 0.254 mm, drill 0.35 mm